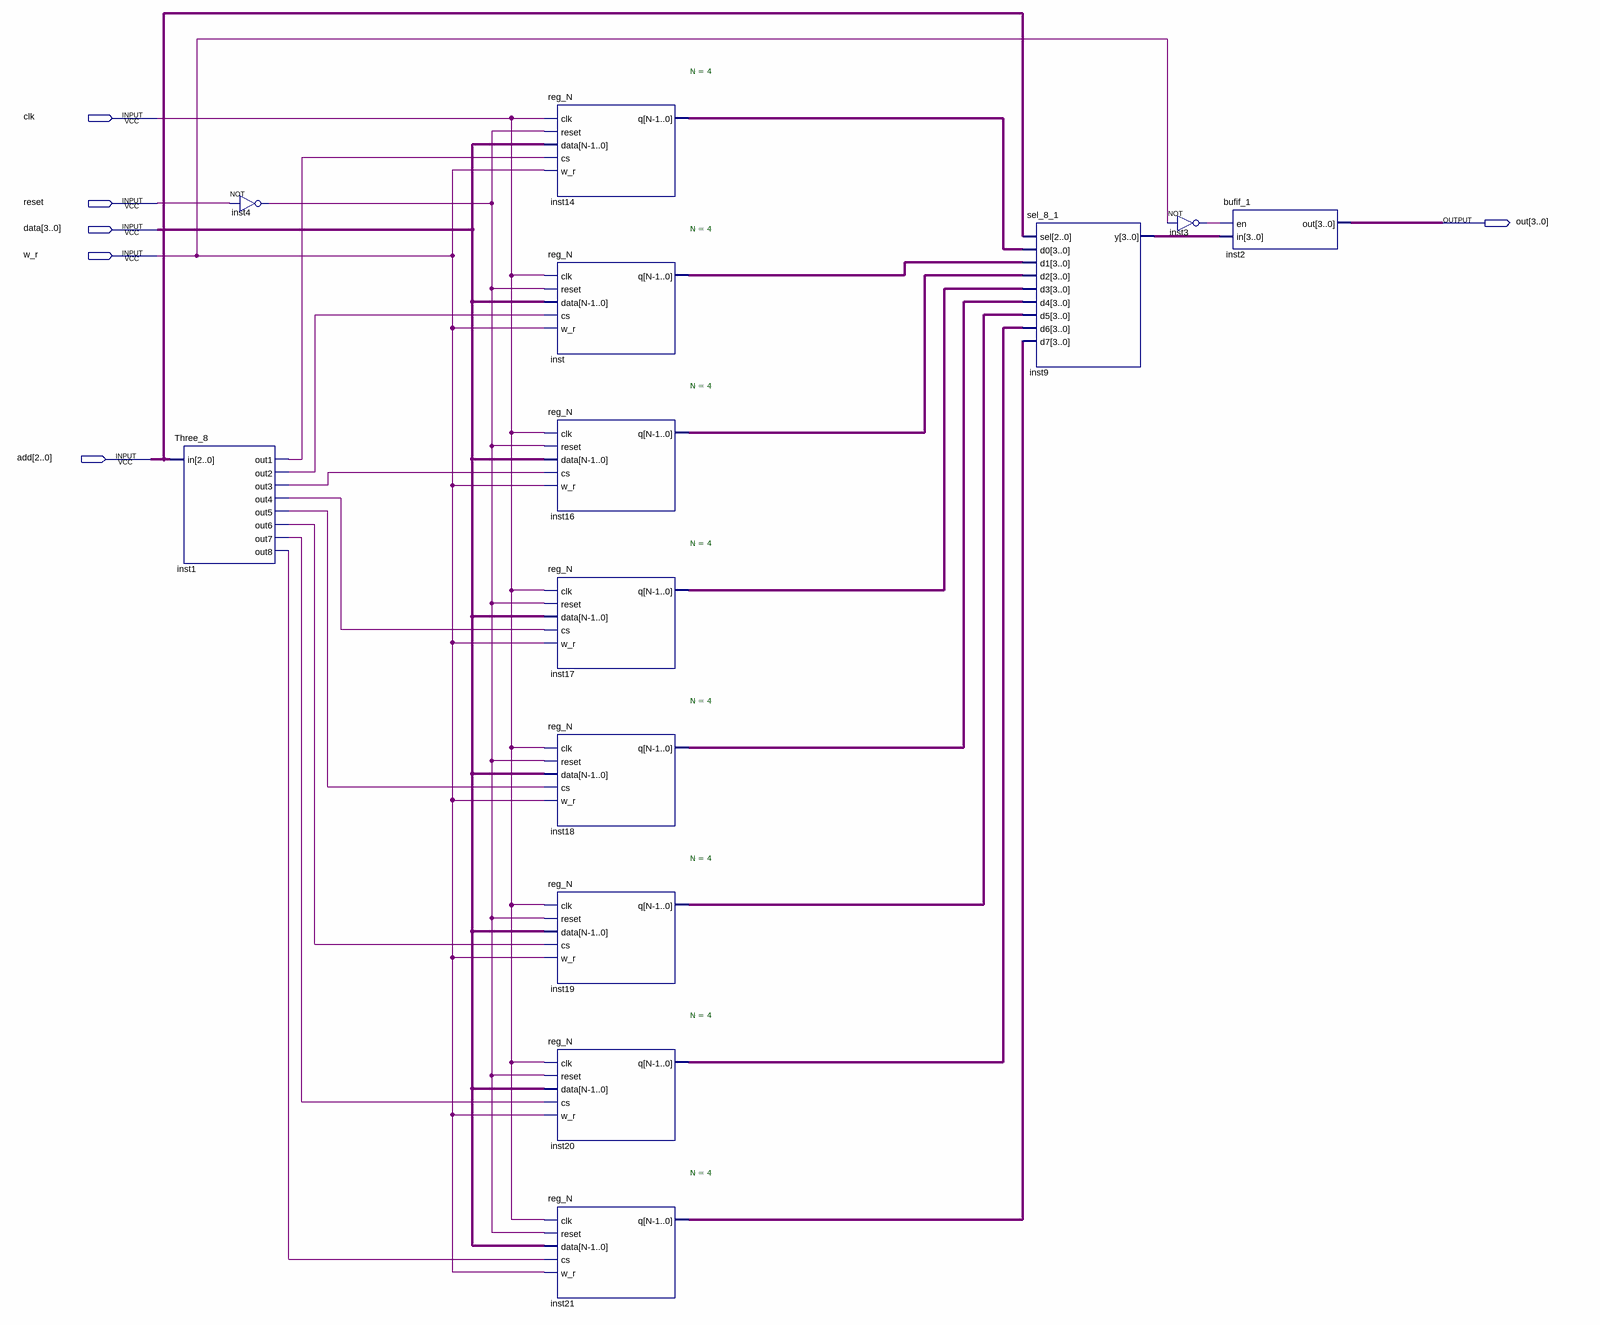
[diagram p0: schematic sheet]
// Quartus schematic reg_NN.bdf as structural Verilog: 13 symbols, 6 pins
module reg_NN (
  input  clk,
  input  reset,
  input  [3:0] data,
  input  w_r,
  input  [2:0] add,
  output [3:0] out
);

  wire inst1_out1, inst1_out2, inst1_out3, inst1_out4, inst1_out5, inst1_out6, inst1_out7, inst1_out8,
       inst3_out, inst4_out;
  wire [3:0] inst9_y, inst14_q, inst16_q, inst17_q, inst18_q, inst19_q, inst20_q, inst21_q, inst_q;

  Three_8 inst1 (
    .in(add), .out1(inst1_out1), .out2(inst1_out2), .out3(inst1_out3), .out4(inst1_out4), .out5(inst1_out5),
    .out6(inst1_out6), .out7(inst1_out7), .out8(inst1_out8));
  not inst4 (inst4_out, reset);
  reg_N #(.N(4)) inst14 (.clk(clk), .reset(inst4_out), .data(data), .cs(inst1_out1), .w_r(w_r), .q(inst14_q));
  reg_N #(.N(4)) inst (.clk(clk), .reset(inst4_out), .data(data), .cs(inst1_out2), .w_r(w_r), .q(inst_q));
  reg_N #(.N(4)) inst16 (.clk(clk), .reset(inst4_out), .data(data), .cs(inst1_out3), .w_r(w_r), .q(inst16_q));
  reg_N #(.N(4)) inst17 (.clk(clk), .reset(inst4_out), .data(data), .cs(inst1_out4), .w_r(w_r), .q(inst17_q));
  reg_N #(.N(4)) inst18 (.clk(clk), .reset(inst4_out), .data(data), .cs(inst1_out5), .w_r(w_r), .q(inst18_q));
  reg_N #(.N(4)) inst19 (.clk(clk), .reset(inst4_out), .data(data), .cs(inst1_out6), .w_r(w_r), .q(inst19_q));
  reg_N #(.N(4)) inst20 (.clk(clk), .reset(inst4_out), .data(data), .cs(inst1_out7), .w_r(w_r), .q(inst20_q));
  reg_N #(.N(4)) inst21 (.clk(clk), .reset(inst4_out), .data(data), .cs(inst1_out8), .w_r(w_r), .q(inst21_q));
  sel_8_1 inst9 (
    .sel(add), .d0(inst14_q), .d1(inst_q), .d2(inst16_q), .d3(inst17_q), .d4(inst18_q), .d5(inst19_q),
    .d6(inst20_q), .d7(inst21_q), .y(inst9_y));
  not inst3 (inst3_out, w_r);
  bufif_1 inst2 (.en(inst3_out), .in(inst9_y), .out(out));
endmodule
